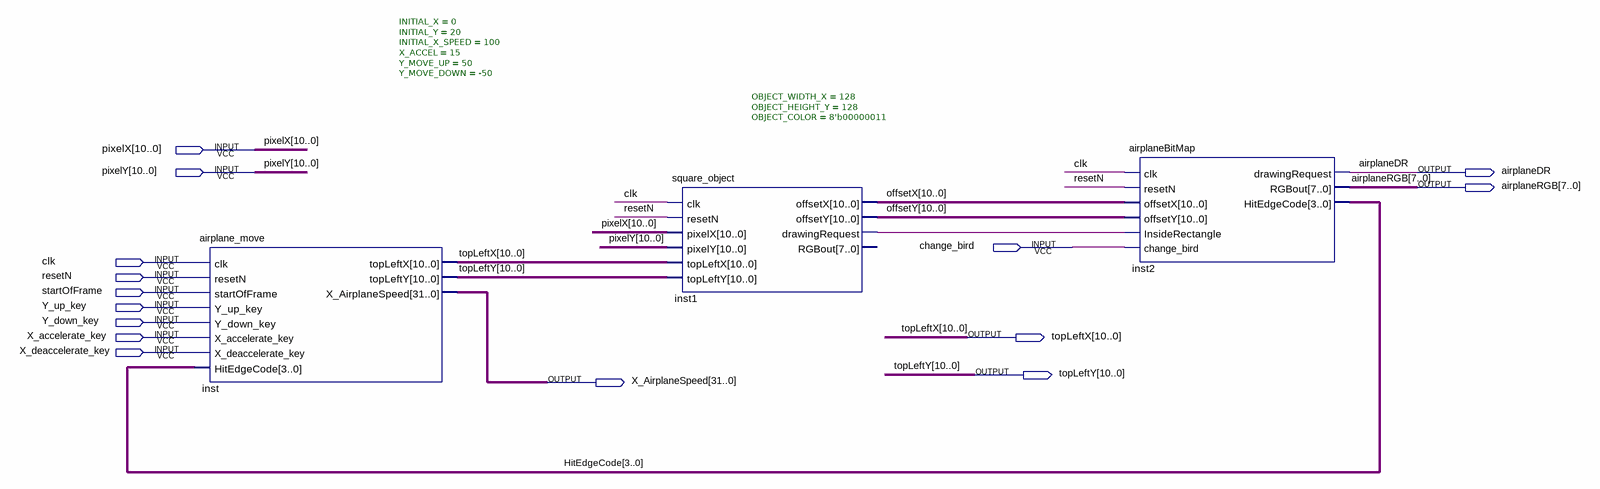
[diagram p0: schematic sheet]
// Quartus schematic Airplane_Block_T.bdf as structural Verilog: 3 symbols, 15 pins
module Airplane_Block_T (
  input  [10:0] pixelX,
  input  [10:0] pixelY,
  input  change_bird,
  input  clk,
  input  resetN,
  input  startOfFrame,
  input  Y_up_key,
  input  Y_down_key,
  input  X_accelerate_key,
  input  X_deaccelerate_key,
  output airplaneDR,
  output [7:0] airplaneRGB,
  output [10:0] topLeftX,
  output [10:0] topLeftY,
  output [31:0] X_AirplaneSpeed
);

  wire inst1_drawingrequest;
  wire [3:0] HitEdgeCode;
  wire [10:0] offsetX, offsetY;

  airplane_move #(.INITIAL_X(0), .INITIAL_Y(20), .INITIAL_X_SPEED(100), .X_ACCEL(15), .Y_MOVE_UP(50), .Y_MOVE_DOWN(-50)) inst (
    .clk(clk), .resetN(resetN), .startOfFrame(startOfFrame), .Y_up_key(Y_up_key), .Y_down_key(Y_down_key),
    .X_accelerate_key(X_accelerate_key), .X_deaccelerate_key(X_deaccelerate_key), .HitEdgeCode(HitEdgeCode),
    .topLeftX(topLeftX), .topLeftY(topLeftY), .X_AirplaneSpeed(X_AirplaneSpeed));
  square_object #(.OBJECT_WIDTH_X(128), .OBJECT_HEIGHT_Y(128), .OBJECT_COLOR(8'b00000011)) inst1 (
    .clk(clk), .resetN(resetN), .pixelX(pixelX), .pixelY(pixelY), .topLeftX(topLeftX), .topLeftY(topLeftY),
    .offsetX(offsetX), .offsetY(offsetY), .drawingRequest(inst1_drawingrequest));  // open: RGBout
  airplaneBitMap inst2 (
    .clk(clk), .resetN(resetN), .offsetX(offsetX), .offsetY(offsetY), .InsideRectangle(inst1_drawingrequest),
    .change_bird(change_bird), .drawingRequest(airplaneDR), .RGBout(airplaneRGB), .HitEdgeCode(HitEdgeCode));
endmodule
